# Altium project MPPT.PrjPcb
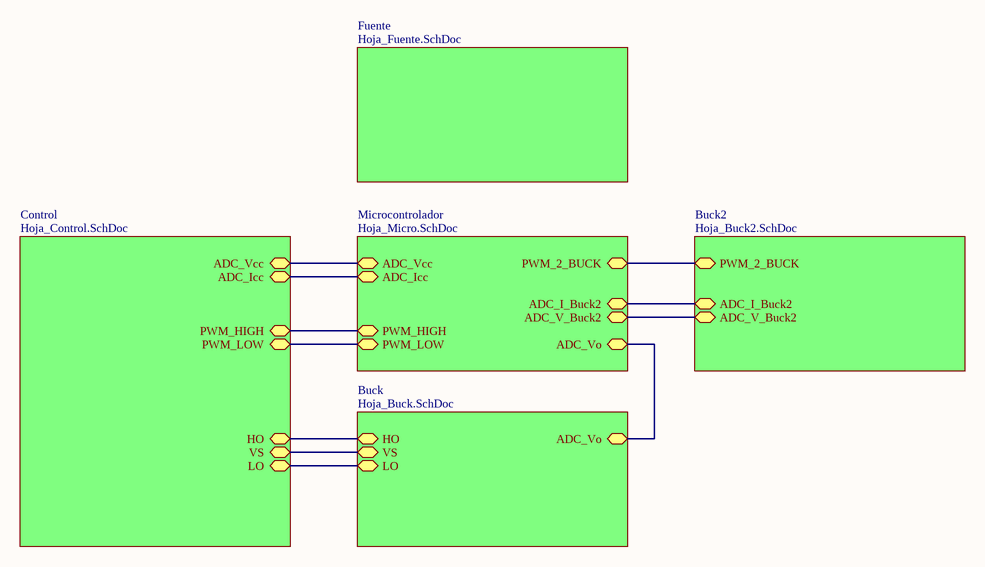
[diagram p0: Hoja_Master.SchDoc]
6 sheets, 115 parts. Net scope: hierarchical (ports join the sheet entries above them; power ports are global).
Board file: PCB_MPPT.PcbDoc
Sheets:
  Hoja_Master.SchDoc
    Fuente = Hoja_Fuente.SchDoc
    Microcontrolador = Hoja_Micro.SchDoc
    Buck = Hoja_Buck.SchDoc
    Control = Hoja_Control.SchDoc
    Buck2 = Hoja_Buck2.SchDoc

## Sheet Hoja_Master.SchDoc: Hoja_Master
size A4; SheetNumber: 1; SheetTotal: 6

### Sub-sheets
Buck = Hoja_Buck.SchDoc: HO (bidir), LO (bidir), VS (bidir), ADC_Vo (bidir)
Buck2 = Hoja_Buck2.SchDoc: ADC_I_Buck2 (bidir), ADC_V_Buck2 (bidir), PWM_2_BUCK (bidir)
Control = Hoja_Control.SchDoc: ADC_Vcc (bidir), ADC_Icc (bidir), PWM_HIGH (bidir), HO (bidir), LO (bidir), VS (bidir), PWM_LOW (bidir)
Fuente = Hoja_Fuente.SchDoc: no entries
Microcontrolador = Hoja_Micro.SchDoc: ADC_Vcc (bidir), ADC_Icc (bidir), PWM_HIGH (bidir), PWM_LOW (bidir), ADC_I_Buck2 (bidir), ADC_V_Buck2 (bidir), ADC_Vo (bidir), PWM_2_BUCK (bidir)

### Nets
ADC_I_Buck2: sheet Microcontrolador/ADC_I_Buck2, sheet Buck2/ADC_I_Buck2
ADC_Icc: sheet Microcontrolador/ADC_Icc, sheet Control/ADC_Icc
ADC_V_Buck2: sheet Microcontrolador/ADC_V_Buck2, sheet Buck2/ADC_V_Buck2
ADC_Vcc: sheet Microcontrolador/ADC_Vcc, sheet Control/ADC_Vcc
ADC_Vo: sheet Microcontrolador/ADC_Vo, sheet Buck/ADC_Vo
PWM_1: sheet Microcontrolador/PWM_HIGH, sheet Control/PWM_HIGH
PWM_2: sheet Microcontrolador/PWM_LOW, sheet Control/PWM_LOW
PWM_3: sheet Microcontrolador/PWM_2_BUCK, sheet Buck2/PWM_2_BUCK
NetC19_1: sheet Buck/VS, sheet Control/VS
NetHO_1: sheet Buck/HO, sheet Control/HO
NetLO_1: sheet Buck/LO, sheet Control/LO

### Notes on the sheet
- Title:
- Size:
- Author:
- A4
- Sheet
- of
- Revision:
- File:
- Date:

## Sheet Hoja_Fuente.SchDoc: Hoja_Fuente
size A4; SheetNumber: 2; SheetTotal: 6
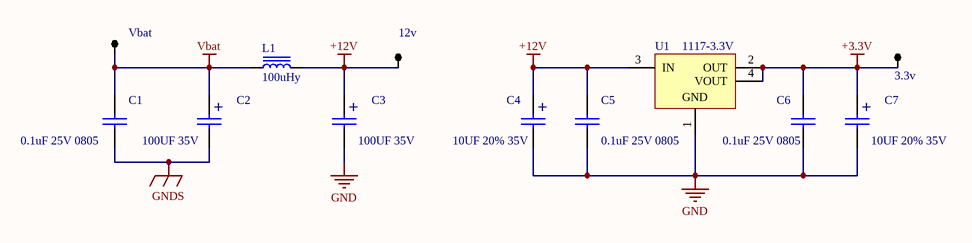
[diagram p1: Hoja_Fuente.SchDoc]

### Parts
3.3v  3.3v  [TPTH]
12v  12v  [TPTH]  (value not drawn)
C1  0.1uF 25V 0805  [0805]
C2  100UF 35V  [CAPSMD8x8.3]
C3  100UF 35V  [CAPSMD8x8.3]
C4  10UF 20% 35V  [CAPSMD4.3x4.3]
C5  0.1uF 25V 0805  [0805]
C6  0.1uF 25V 0805  [0805]
C7  10UF 20% 35V  [CAPSMD4.3x4.3]
L1  100uHy  [SRR1210]
U1  1117-3.3V  [SOT223]
Vbat  Vbat  [TPTH]  (value not drawn)

### Nets
+3.3V: 3.3v.1 C6.1 C7.1 U1.2(OUT) U1.4(VOUT)
+12V: 12v.1 C3.1 C4.1 C5.1 L1.2 U1.3(IN)
GND: C1.2 C2.2 C3.2 C4.2 C5.2 C6.2 C7.2 U1.1(GND)  [also labelled GNDS]
Vbat: C1.1 C2.1 L1.1 Vbat.1

### Notes on the sheet
- Title:
- Size:
- Author:
- A4
- Sheet
- of
- Revision:
- File:
- Date:
- (in symbol CAPPOL) +

### Library data of the parts
3.3v 12v Vbat = TP
C1 C5 C6 = CAP
C2 C3 = CAPPOL: Capacitores electrolíticos de aluminio 100 µF 35 V Radial, encapsulado - terminales SMD 1000 h a 105°C
C4 C7 = CAPPOL: Capacitores electrolíticos de aluminio 10 µF 35 V Radial, encapsulado - terminales SMD 2000 h a 105°C
L1 = INDUCTOR: SRR1210-101M - 100 µH Blindado Drum Core, Wirewound Inductivo 2.5 A 135mOhm máx. No estándar
U1 = LT1117CST-3.3: IC REG LINEAR 3.3V 800MA SOT223; Manufacturer: Linear Technology; Discrete Pass Element: no; Dropout Voltage(V): 1.1; Iout(mA): 800; Isupply(mA): 5; Number of Outputs: 1; PSRR(dB): 75; Vin Max(V): 15; Vin Min(V): 2.45; DatasheetVersion: Rev. D; PackageVersion: Jun-10; PackageReference: ST-3; PackageDescription: 3-Pin Plastic SOT-223, 3.505 x 6.505 mm Body, Pitch 2.3 mm; Supplier 1: Digi-Key; Supplier Part Number 1: LT1117CST-3.3-ND; Supplier 2: Newark; Supplier Part Number 2: 57M1797; Output Voltage: 3.3 V; RoHS: FALSE; Mounting Technology: Surface Mount; PartNumber: LT1117CST-3.3; ComponentLink1Description: Manufacturer URL; ComponentLink1URL: http://www.linear.com/; ComponentLink2Description: Datasheet; ComponentLink2URL: http://cds.linear.com/docs/en/datasheet/1117fd.pdf; ComponentLink3Description: Package Specification; ComponentLink3URL: http://cds.linear.com/docs/en/packaging/SOT_3_05-08-1630.pdf

## Sheet Hoja_Micro.SchDoc: Hoja_Micro
size A4; SheetNumber: 3; SheetTotal: 6
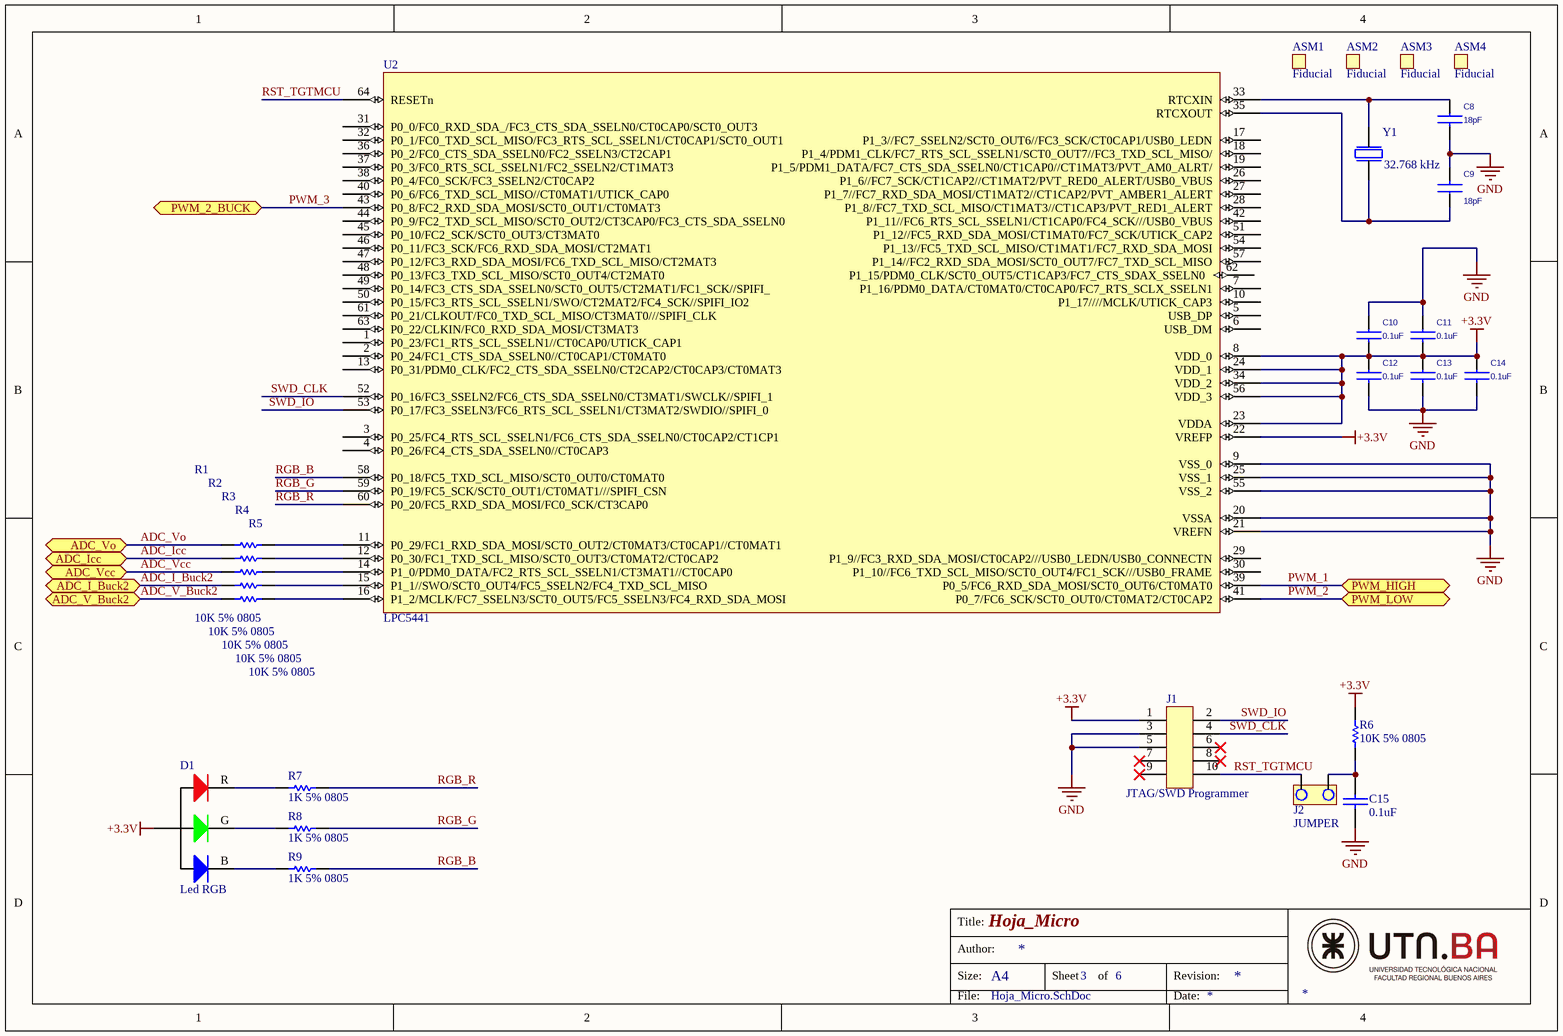
[diagram p2: Hoja_Micro.SchDoc]

### Parts
ASM1  Fiducial  [Fiducial]
ASM2  Fiducial  [Fiducial]
ASM3  Fiducial  [Fiducial]
ASM4  Fiducial  [Fiducial]
C8  18pF  [0805]
C9  18pF  [0805]
C10  0.1uF  [0805]
C11  0.1uF  [0805]
C12  0.1uF  [0805]
C13  0.1uF  [0805]
C14  0.1uF  [0805]
C15  0.1uF  [0805]
D1  Led RGB  [4-plcc]
J1  JTAG/SWD Programmer  [FTSH-105-01-XXX-DV-K]
J2  JUMPER  [JUMPER2]
R1  10K 5% 0805  [0805]
R2  10K 5% 0805  [0805]
R3  10K 5% 0805  [0805]
R4  10K 5% 0805  [0805]
R5  10K 5% 0805  [0805]
R6  10K 5% 0805  [0805]
R7  1K 5% 0805  [0805]
R8  1K 5% 0805  [0805]
R9  1K 5% 0805  [0805]
U2  LPC5441  [LQFP64]
Y1  32.768 kHz  [ABS07_Xtal]

### Ports
ADC_I_Buck2 (bidir), ADC_Icc (bidir), ADC_V_Buck2 (bidir), ADC_Vcc (bidir), ADC_Vo (bidir), PWM_2_BUCK (bidir), PWM_HIGH (bidir), PWM_LOW (bidir)

### Nets
+3.3V: C10.2 C11.2 C12.1 C13.1 C14.1 D1.A J1.1 R6.2 U2.8(VDD_0) U2.22(VREFP) U2.23(VDDA) U2.24(VDD_1) U2.34(VDD_2) U2.56(VDD_3)
GND: C8.2 C9.2 C10.1 C11.1 C12.2 C13.2 C14.2 C15.2 J1.3 J1.5 U2.9(VSS_0) U2.20(VSSA) U2.21(VREFN) U2.25(VSS_1) U2.55(VSS_2)
ADC_I_Buck2: R4.2 ; port ADC_I_Buck2
ADC_Icc: R2.2 ; port ADC_Icc
ADC_V_Buck2: R5.2 ; port ADC_V_Buck2
ADC_Vcc: R3.2 ; port ADC_Vcc
ADC_Vo: R1.2 ; port ADC_Vo
PWM_1: U2.39(P0_5/FC6_RXD_SDA_MOSI/SCT0_OUT6/CT0MAT0) ; port PWM_HIGH
PWM_2: U2.41(P0_7/FC6_SCK/SCT0_OUT0/CT0MAT2/CT0CAP2) ; port PWM_LOW
PWM_3: U2.43(P0_8/FC2_RXD_SDA_MOSI/SCT0_OUT1/CT0MAT3) ; port PWM_2_BUCK
RGB_B: R9.1 U2.58(P0_18/FC5_TXD_SCL_MISO/SCT0_OUT0/CT0MAT0)
RGB_G: R8.1 U2.59(P0_19/FC5_SCK/SCT0_OUT1/CT0MAT1///SPIFI_CSN)
RGB_R: R7.1 U2.60(P0_20/FC5_RXD_SDA_MOSI/FC0_SCK/CT3CAP0)
RST_TGTMCU: J1.10 J2.1 U2.64(RESETn)
SWD_CLK: J1.4 U2.52(P0_16/FC3_SSELN2/FC6_CTS_SDA_SSELN0/CT3MAT1/SWCLK//SPIFI_1)
SWD_IO: J1.2 U2.53(P0_17/FC3_SSELN3/FC6_RTS_SCL_SSELN1/CT3MAT2/SWDIO//SPIFI_0)
NetC8_1: C8.1 U2.33(RTCXIN) Y1.2
NetC9_1: C9.1 U2.35(RTCXOUT) Y1.1
NetC15_1: C15.1 J2.2 R6.1
NetD1_B: D1.B R9.2
NetD1_G: D1.G R8.2
NetD1_R: D1.R R7.2
NetR1_1: R1.1 U2.11(P0_29/FC1_RXD_SDA_MOSI/SCT0_OUT2/CT0MAT3/CT0CAP1//CT0MAT1)
NetR2_1: R2.1 U2.12(P0_30/FC1_TXD_SCL_MISO/SCT0_OUT3/CT0MAT2/CT0CAP2)
NetR3_1: R3.1 U2.14(P1_0/PDM0_DATA/FC2_RTS_SCL_SSELN1/CT3MAT1//CT0CAP0)
NetR4_1: R4.1 U2.15(P1_1//SWO/SCT0_OUT4/FC5_SSELN2/FC4_TXD_SCL_MISO)
NetR5_1: R5.1 U2.16(P1_2/MCLK/FC7_SSELN3/SCT0_OUT5/FC5_SSELN3/FC4_RXD_SDA_MOSI)

Not connected (* = marked no-connect by the designer): J1 6(43)* 7(39)* 8(42)* 9(40)*; U2 1(P0_23/FC1_RTS_SCL_SSELN1//CT0CAP0/UTICK_CAP1) 2(P0_24/FC1_CTS_SDA_SSELN0//CT0CAP1/CT0MAT0) 3(P0_25/FC4_RTS_SCL_SSELN1/FC6_CTS_SDA_SSELN0/CT0CAP2/CT1CP1) 4(P0_26/FC4_CTS_SDA_SSELN0//CT0CAP3) 5(USB_DP) 6(USB_DM) 7(P1_16/PDM0_DATA/CT0MAT0/CT0CAP0/FC7_RTS_SCLX_SSELN1) 10(P1_17////MCLK/UTICK_CAP3) 13(P0_31/PDM0_CLK/FC2_CTS_SDA_SSELN0/CT2CAP2/CT0CAP3/CT0MAT3) 17(P1_3//FC7_SSELN2/SCT0_OUT6//FC3_SCK/CT0CAP1/USB0_LEDN) 18(P1_4/PDM1_CLK/FC7_RTS_SCL_SSELN1/SCT0_OUT7//FC3_TXD_SCL_MISO/) 19(P1_5/PDM1_DATA/FC7_CTS_SDA_SSELN0/CT1CAP0//CT1MAT3/PVT_AM0_ALRT/) 26(P1_6//FC7_SCK/CT1CAP2//CT1MAT2/PVT_RED0_ALERT/USB0_VBUS) 27(P1_7//FC7_RXD_SDA_MOSI/CT1MAT2//CT1CAP2/PVT_AMBER1_ALERT) 28(P1_8//FC7_TXD_SCL_MISO/CT1MAT3//CT1CAP3/PVT_RED1_ALERT) 29(P1_9//FC3_RXD_SDA_MOSI/CT0CAP2///USB0_LEDN/USB0_CONNECTN) 30(P1_10//FC6_TXD_SCL_MISO/SCT0_OUT4/FC1_SCK///USB0_FRAME) 31(P0_0/FC0_RXD_SDA_/FC3_CTS_SDA_SSELN0/CT0CAP0/SCT0_OUT3) 32(P0_1/FC0_TXD_SCL_MISO/FC3_RTS_SCL_SSELN1/CT0CAP1/SCT0_OUT1) 36(P0_2/FC0_CTS_SDA_SSELN0/FC2_SSELN3/CT2CAP1) 37(P0_3/FC0_RTS_SCL_SSELN1/FC2_SSELN2/CT1MAT3) 38(P0_4/FC0_SCK/FC3_SSELN2/CT0CAP2) 40(P0_6/FC6_TXD_SCL_MISO//CT0MAT1/UTICK_CAP0) 42(P1_11//FC6_RTS_SCL_SSELN1/CT1CAP0/FC4_SCK///USB0_VBUS) 44(P0_9/FC2_TXD_SCL_MISO/SCT0_OUT2/CT3CAP0/FC3_CTS_SDA_SSELN0) 45(P0_10/FC2_SCK/SCT0_OUT3/CT3MAT0) 46(P0_11/FC3_SCK/FC6_RXD_SDA_MOSI/CT2MAT1) 47(P0_12/FC3_RXD_SDA_MOSI/FC6_TXD_SCL_MISO/CT2MAT3) 48(P0_13/FC3_TXD_SCL_MISO/SCT0_OUT4/CT2MAT0) 49(P0_14/FC3_CTS_SDA_SSELN0/SCT0_OUT5/CT2MAT1/FC1_SCK//SPIFI_) 50(P0_15/FC3_RTS_SCL_SSELN1/SWO/CT2MAT2/FC4_SCK//SPIFI_IO2) 51(P1_12//FC5_RXD_SDA_MOSI/CT1MAT0/FC7_SCK/UTICK_CAP2) 54(P1_13//FC5_TXD_SCL_MISO/CT1MAT1/FC7_RXD_SDA_MOSI) 57(P1_14//FC2_RXD_SDA_MOSI/SCT0_OUT7/FC7_TXD_SCL_MISO) 61(P0_21/CLKOUT/FC0_TXD_SCL_MISO/CT3MAT0///SPIFI_CLK) 62(P1_15/PDM0_CLK/SCT0_OUT5/CT1CAP3/FC7_CTS_SDAX_SSELN0) 63(P0_22/CLKIN/FC0_RXD_SDA_MOSI/CT3MAT3)

### Notes on the sheet
- Title:
- Size:
- Author:
- A4
- Sheet
- of
- Revision:
- File:
- Date:

### Library data of the parts
ASM1-ASM4 = Fiducial: Fiducial Mark for PCB Asembly on Pick N' Place
C8 C9 = CAPACITOR NON-POL: CAP CER 0.1UF X7R 0805
C10-C14 = CAP NP: CAP CER 0.1UF X7R 0805
C15 = CAP: CAP CER 0.1UF X7R 0805
D1 = LED_RGB: CREE LED P/N: CLV1L-FKB-CHMMQEHBB7673673CT-ND / CREE LED P/N: CLMVC-FKA-CL1D1L71BB7C3C3CT-ND
J1 = JTAG: CONN HEADER 10POS DUAL .05" SMD -> FTSH-105-01-F-DV-K
R1-R5 R7-R9 = RES
R6 = RES: RES SMD 10K OHM 5% 1/8W 0805
Y1 = XTAL ABS07: XTAL ABS07 by ABRACON LLC

## Sheet Hoja_Buck.SchDoc: Hoja_Buck
size A4; SheetNumber: 5; SheetTotal: 6; Time: Hoja_Buck
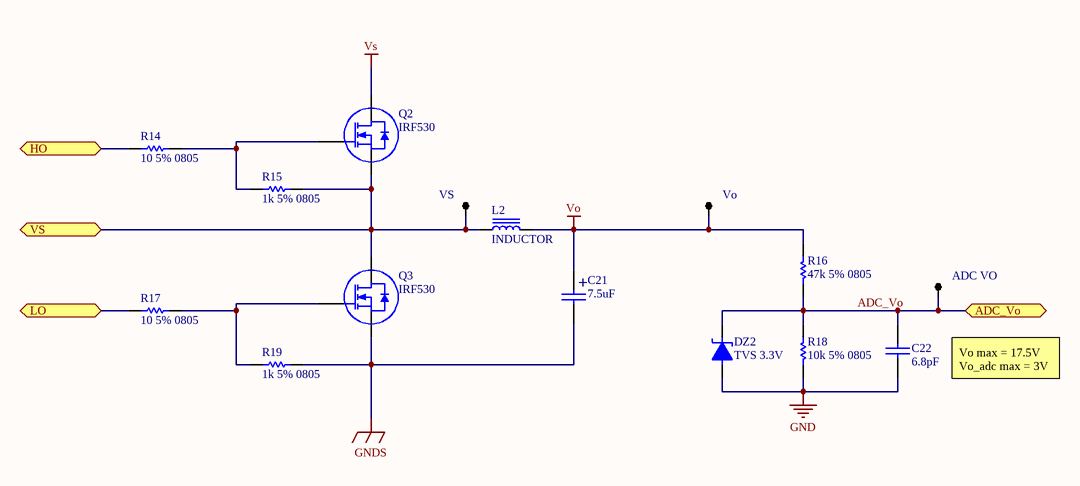
[diagram p3: Hoja_Buck.SchDoc]

### Parts
ADC_VO  ADC Vo  [TPTH]  (value not drawn)
C21  7.5uF  [CAPSMD10x10.3]
C22  6.8pF  [0805]
DZ2  TVS 3.3V  [sod123]
L2  INDUCTOR  [IND_HCTI-220-5.8]
Q2  IRF530  [TO-220 V]
Q3  IRF530  [TO-220 V]
R14  10 5% 0805  [0805]
R15  1k 5% 0805  [0805]
R16  47k 5% 0805  [0805]
R17  10 5% 0805  [0805]
R18  10k 5% 0805  [0805]
R19  1k 5% 0805  [0805]
Vo  Vo  [TPTH]  (value not drawn)
VS  VS  [TPTH]  (value not drawn)

### Ports
ADC_Vo (bidir), HO (bidir), LO (bidir), VS (bidir)

### Nets
GND: C21.2 C22.2 DZ2.1 Q3.3(S) R18.1 R19.1  [also labelled GNDS]
Vo: C21.1 L2.2 R16.2 Vo.1
Vs: Q2.2(D)
ADC_Vo: ADC_VO.1 C22.1 DZ2.2 R16.1 R18.2 ; port ADC_Vo
NetC19_1: L2.1 Q2.3(S) Q3.2(D) R15.1 VS.1 ; port VS
NetHO_1: R14.2 ; port HO
NetLO_1: R17.2 ; port LO
NetQ2_1: Q2.1(G) R14.1 R15.2
NetQ3_1: Q3.1(G) R17.1 R19.2

### Notes on the sheet
- Vo max = 17.5V
  Vo_adc max = 3V
- Title:
- Size:
- Author:
- A4
- Sheet
- of
- Revision:
- File:
- Date:
- (in symbol CAPPOL) +

### Library data of the parts
ADC_VO Vo VS = TP
C21 = CAPPOL: CAP ALUM 7.5UF 20% 450V SMD
C22 = CAP
DZ2 = DIODO ZENER
Q2 Q3 = MOSFET N
R14-R19 = RES

## Sheet Hoja_Control.SchDoc: Hoja_Control
size A4; SheetNumber: 4; SheetTotal: 6; Time: Hoja de Control
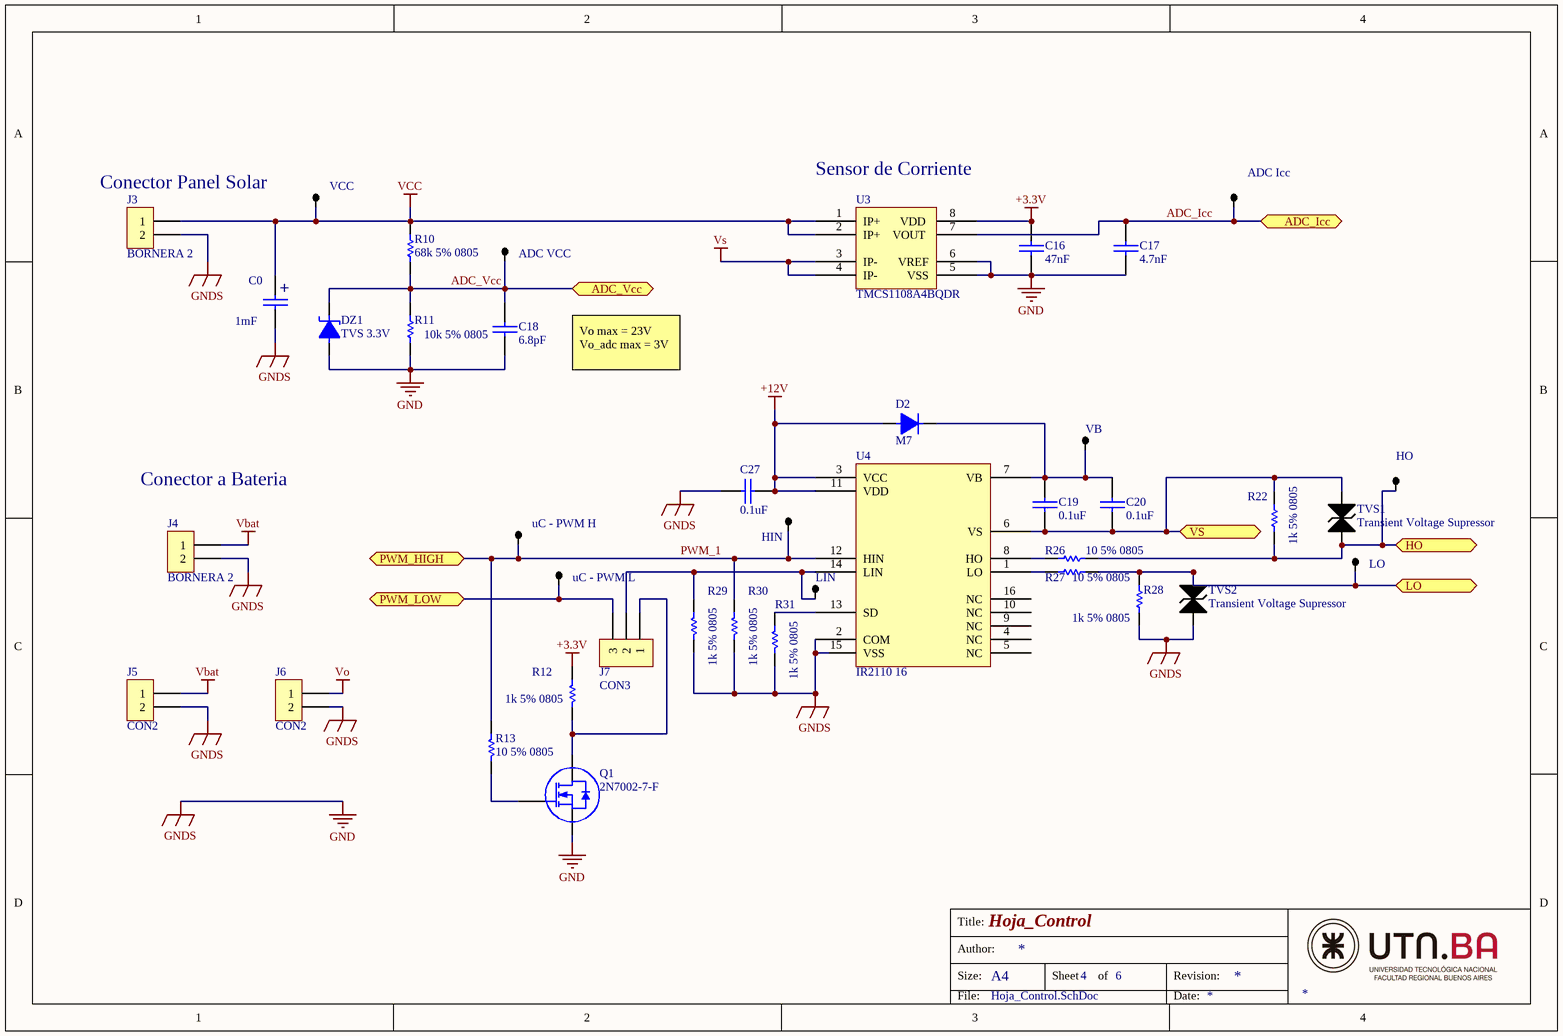
[diagram p4: Hoja_Control.SchDoc]

### Parts
ADC_Icc  ADC Icc  [TPTH]  (value not drawn)
ADC_VCC  ADC VCC  [TPTH]  (value not drawn)
C0  1mF  [CAPSMD8x8.3]
C16  47nF  [0805]
C17  4.7nF  [0805]
C18  6.8pF  [0805]
C19  0.1uF  [0805]
C20  0.1uF  [0805]
C27  0.1uF  [0805]
D2  M7  [DO-214AC]
DZ1  TVS 3.3V  [sod123]
HIN  HIN  [TPTH]
HO  HO  [TPTH]  (value not drawn)
J3  BORNERA 2  [Bornera2_DegsonH]
J4  BORNERA 2  [Bornera2_DegsonH]
J5  CON2  [SIP2]
J6  CON2  [SIP2]
J7  CON3  [SIP3]
LIN  LIN  [TPTH]  (value not drawn)
LO  LO  [TPTH]  (value not drawn)
Q1  2N7002-7-F  [SOT23]
R10  68k 5% 0805  [0805]
R11  10k 5% 0805  [0805]
R12  1k 5% 0805  [0805]
R13  10 5% 0805  [0805]
R22  1k 5% 0805  [0805]
R26  10 5% 0805  [0805]
R27  10 5% 0805  [0805]
R28  1k 5% 0805  [0805]
R29  1k 5% 0805  [0805]
R30  1k 5% 0805  [0805]
R31  1k 5% 0805  [0805]
TVS1  Transient Voltage Supressor  [SOD323]
TVS2  Transient Voltage Supressor  [SOD323]
U3  TMCS1108A4BQDR  [SOIC8]
U4  IR2110 16  [SOIC16W]
uC_-_PWM_H  PWM L  [TPTH]  (value not drawn)
uC_-_PWM_L  PWM H  [TPTH]  (value not drawn)
VB  VB  [TPTH]  (value not drawn)
VCC  VCC  [TPTH]  (value not drawn)

### Ports
ADC_Icc (bidir), ADC_Vcc (bidir), HO (bidir), LO (bidir), PWM_HIGH (bidir), PWM_LOW (bidir), VS (bidir)

### Nets
+3.3V: C16.1 R12.2 U3.8(VDD)
+12V: C27.1 D2.1 U4.3(VCC) U4.11(VDD)
GND: C0.2 C16.2 C17.2 C18.2 C27.2 DZ1.1 J3.2 J4.2 J5.2 J6.2 Q1.3(S) R11.1 R28.1 R29.1 R30.1 R31.1 TVS2.2 U3.5(VSS) U3.6(VREF) U4.2(COM) U4.15(VSS)  [also labelled GNDS]
Vbat: J4.1 J5.1
VCC: C0.1 J3.1 R10.2 U3.1(IP+) U3.2(IP+) VCC.1
Vo: J6.1
Vs: U3.3(IP-) U3.4(IP-)
ADC_Icc: ADC_Icc.1 C17.1 U3.7(VOUT) ; port ADC_Icc
ADC_Vcc: ADC_VCC.1 C18.1 DZ1.2 R10.1 R11.2 ; port ADC_Vcc
PWM_1: HIN.1 R13.2 R30.2 U4.12(HIN) uC_-_PWM_L.1 ; port PWM_HIGH
PWM_2: J7.3 uC_-_PWM_H.1 ; port PWM_LOW
NetC19_1: C19.1 C20.1 R22.2 TVS1.1 U4.6(VS) ; port VS
NetC19_2: C19.2 C20.2 D2.2 U4.7(VB) VB.1
NetHO_1: HO.1 R22.1 R26.2 TVS1.2 ; port HO
NetJ7_1: J7.1 Q1.2(D) R12.1
NetJ7_2: J7.2 LIN.1 R29.2 U4.14(LIN)
NetLO_1: LO.1 R27.2 R28.2 TVS2.1 ; port LO
NetQ1_1: Q1.1(G) R13.1
NetR26_1: R26.1 U4.8(HO)
NetR27_1: R27.1 U4.1(LO)
NetR31_2: R31.2 U4.13(SD)

Not connected (* = marked no-connect by the designer): U4 4(NC) 5(NC) 9(NC) 10(NC) 16(NC)

### Notes on the sheet
- (near U3) Sensor de Corriente
- Conector Panel Solar
- Vo max = 23V
  Vo_adc max = 3V
- Conector a Bateria
- Title:
- Size:
- Author:
- A4
- Sheet
- of
- Revision:
- File:
- Date:
- (in symbol CAPPOL) +

### Library data of the parts
ADC_Icc ADC_VCC HIN HO LIN LO uC_-_PWM_H uC_-_PWM_L VB VCC = TP
C0 = CAPPOL: as C2 on sheet Hoja_Fuente
C16-C18 = CAP
C19 C20 C27 = CAP: CAP CER 0.1UF X7R 0805
D2 = DIODO: Diodos Estándar 1000 V 1A Montaje en superficie SMA
DZ1 = DIODO ZENER
Q1 = MOSFET N: Canal N Montaje en superficie 60 V 115mA (Ta) 370mW (Ta) SOT-23-3
R10-R13 R22 R26-R31 = RES
TVS1 TVS2 = TVS
U3 = MLX91221KDC: Sensores de corriente 1 canal Efecto Hall Bidireccional 8-SOIC (ancho 0.154", 3.90mm)
U4 = IR2110 16: Medio puente controladores de compuerta IC No inversor 14-DIP

## Sheet Hoja_Buck2.SchDoc: Hoja_Buck2
size A4; SheetNumber: 6; SheetTotal: 6
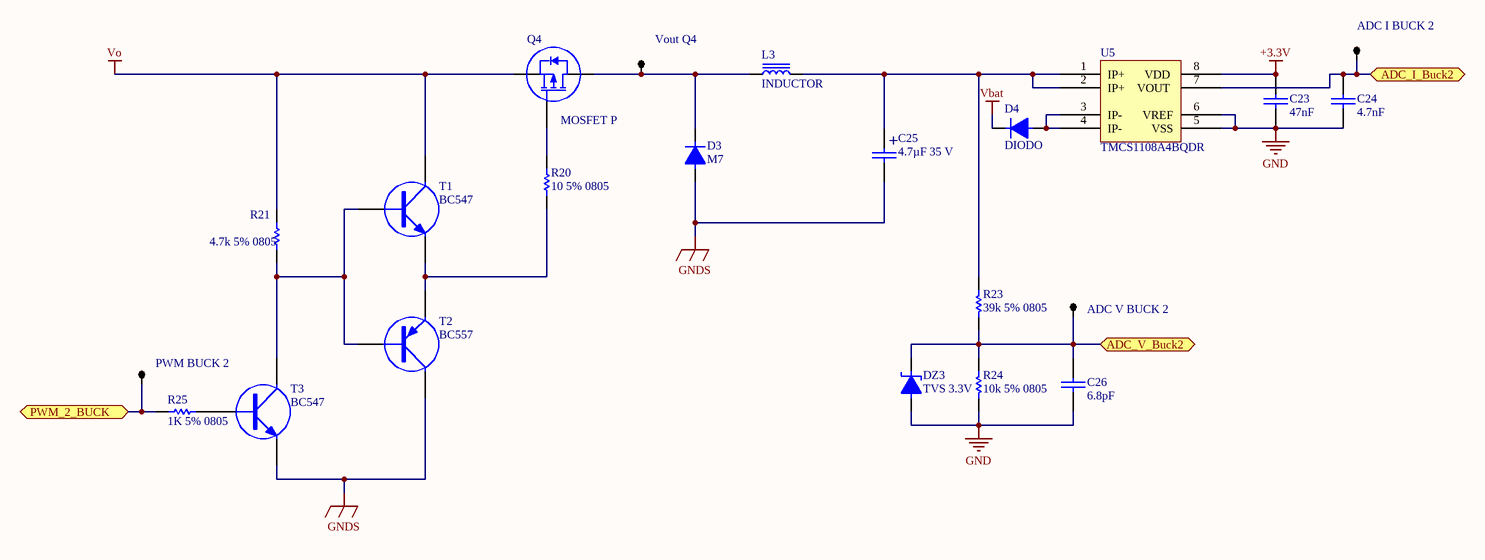
[diagram p5: Hoja_Buck2.SchDoc]

### Parts
ADC_I_BUCK_2  (no value)  [TPTH]
ADC_V_BUCK_2  (no value)  [TPTH]
C23  47nF  [0805]
C24  4.7nF  [0805]
C25  4.7µF 35 V  [CAPSMD8x8.3]
C26  6.8pF  [0805]
D3  M7  [DO-214AC]
D4  DIODO  [SOD123]
DZ3  TVS 3.3V  [sod123]
L3  INDUCTOR  [IND_HCTI-220-5.8]
PWM_BUCK_2  (no value)  [TPTH]
Q4  MOSFET P  [TO-220 V]
R20  10 5% 0805  [0805]
R21  4.7k 5% 0805  [0805]
R23  39k 5% 0805  [0805]
R24  10k 5% 0805  [0805]
R25  1K 5% 0805  [0805]
T1  BC547  [SOT23-3]
T2  BC557  [SOT23-3]
T3  BC547  [SOT23-3]
U5  TMCS1108A4BQDR  [SOIC8]
Vout_Q4  Vout Q4  [TPTH]  (value not drawn)

### Ports
ADC_I_Buck2 (bidir), ADC_V_Buck2 (bidir), PWM_2_BUCK (bidir)

### Nets
+3.3V: C23.1 U5.8(VDD)
GND: C23.2 C24.2 C25.2 C26.2 D3.1 DZ3.1 R24.1 T2.2(C) T3.3(E) U5.5(VSS) U5.6(VREF)  [also labelled GNDS]
Vbat: D4.2
Vo: Q4.3(S) R21.1 T1.2(C)
ADC_I_Buck2: ADC_I_BUCK_2.1 C24.1 U5.7(VOUT) ; port ADC_I_Buck2
ADC_V_Buck2: ADC_V_BUCK_2.1 C26.1 DZ3.2 R23.1 R24.2 ; port ADC_V_Buck2
PWM_3: PWM_BUCK_2.1 R25.1 ; port PWM_2_BUCK
NetC25_1: C25.1 L3.2 R23.2 U5.1(IP+) U5.2(IP+)
NetD3_2: D3.2 L3.1 Q4.2(D) Vout_Q4.1
NetD4_1: D4.1 U5.3(IP-) U5.4(IP-)
NetQ4_1: Q4.1(G) R20.1
NetR20_2: R20.2 T1.3(E) T2.3(E)
NetR21_2: R21.2 T1.1(B) T2.1(B) T3.2(C)
NetR25_2: R25.2 T3.1(B)

### Notes on the sheet
- Title:
- Size:
- Author:
- A4
- Sheet
- of
- Revision:
- File:
- Date:
- (in symbol CAPPOL) +

### Library data of the parts
ADC_I_BUCK_2 ADC_V_BUCK_2 PWM_BUCK_2 Vout_Q4 = TP
C23 C24 C26 = CAP
C25 = CAPPOL
D3 = DIODO: as D2 on sheet Hoja_Control
DZ3 = DIODO ZENER
L3 = INDUCTOR: https://www.delevan.com/-/media/Project/Altramotion/shared/files/Literature/brand/Delevan/pdf/powerinductor/radialleaded/powertoroids/page103_106_ptseries.pdf
R20 R21 R23-R25 = RES
T1 T3 = TRANSISTOR NPN: Transistores - Bipolar (BJT) - Simple NPN 45 V 100 mA 300MHz 500 mW Orificio pasante TO-92-3
T2 = TRANSISTOR PNP: Transistores - Bipolar (BJT) - Simple PNP 45 V 100 mA 150MHz 500 mW Orificio pasante TO-92-3
U5 = MLX91221KDC: as U3 on sheet Hoja_Control

## Nets that join several sheets
+3.3V: Hoja_Fuente (5 pins), Hoja_Micro (14 pins), Hoja_Control (C16.1 R12.2 U3.8), Hoja_Buck2 (C23.1 U5.8)
+12V: Hoja_Fuente (6 pins), Hoja_Control (C27.1 D2.1 U4.3 U4.11)
GND: Hoja_Fuente (8 pins), Hoja_Micro (15 pins), Hoja_Buck (6 pins), Hoja_Control (21 pins), Hoja_Buck2 (11 pins)
Vbat: Hoja_Fuente (C1.1 C2.1 L1.1 Vbat.1), Hoja_Control (J4.1 J5.1), Hoja_Buck2 (D4.2)
Vo: Hoja_Buck (C21.1 L2.2 R16.2 Vo.1), Hoja_Control (J6.1), Hoja_Buck2 (Q4.3 R21.1 T1.2)
Vs: Hoja_Buck (Q2.2), Hoja_Control (U3.3 U3.4)
ADC_I_Buck2: Hoja_Micro (R4.2), Hoja_Buck2 (ADC_I_BUCK_2.1 C24.1 U5.7)
ADC_Icc: Hoja_Micro (R2.2), Hoja_Control (ADC_Icc.1 C17.1 U3.7)
ADC_V_Buck2: Hoja_Micro (R5.2), Hoja_Buck2 (5 pins)
ADC_Vcc: Hoja_Micro (R3.2), Hoja_Control (5 pins)
ADC_Vo: Hoja_Micro (R1.2), Hoja_Buck (5 pins)
NetC19_1: Hoja_Buck (5 pins), Hoja_Control (5 pins)
NetHO_1: Hoja_Buck (R14.2), Hoja_Control (HO.1 R22.1 R26.2 TVS1.2)
NetLO_1: Hoja_Buck (R17.2), Hoja_Control (LO.1 R27.2 R28.2 TVS2.1)
PWM_1: Hoja_Micro (U2.39), Hoja_Control (5 pins)
PWM_2: Hoja_Micro (U2.41), Hoja_Control (J7.3 uC_-_PWM_H.1)
PWM_3: Hoja_Micro (U2.43), Hoja_Buck2 (PWM_BUCK_2.1 R25.1)